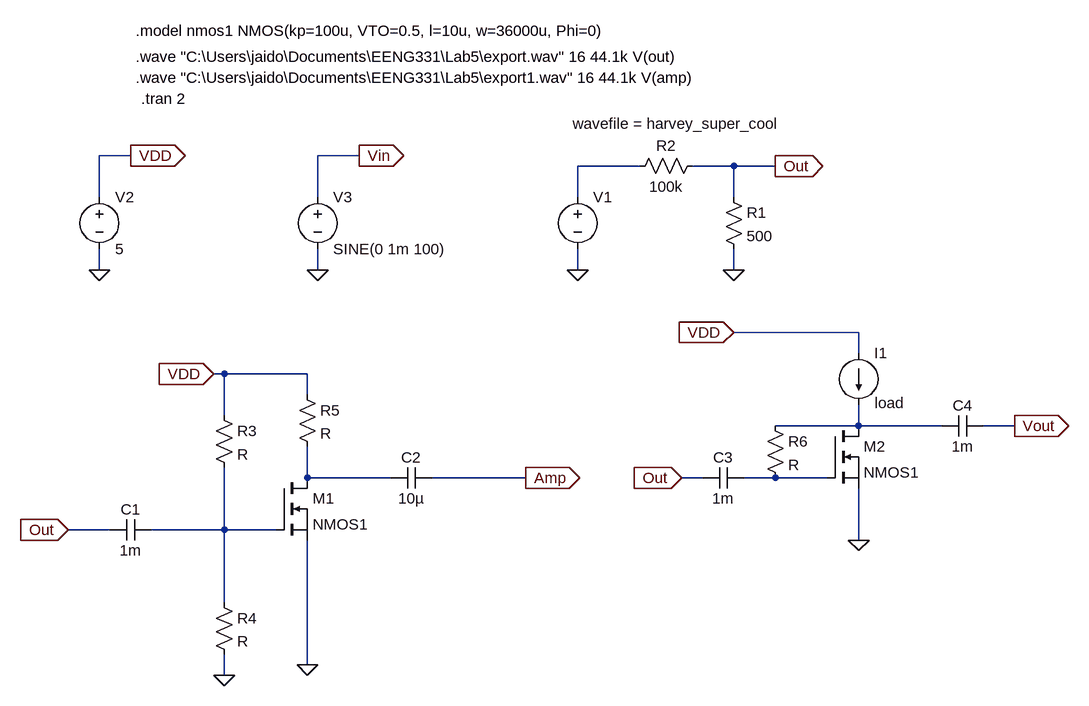
[diagram p0: schematic Lab5.asc]
Lab5.asc, the LTspice schematic file:
Version 4
SHEET 1 1712 852
WIRE 16 32 -32 32
WIRE 368 32 304 32
WIRE 800 48 704 48
WIRE 944 48 880 48
WIRE 1008 48 944 48
WIRE -32 96 -32 32
WIRE 304 96 304 32
WIRE 704 96 704 48
WIRE 944 96 944 48
WIRE -32 208 -32 176
WIRE 304 208 304 176
WIRE 704 208 704 176
WIRE 944 208 944 176
WIRE 1136 304 944 304
WIRE 1136 336 1136 304
WIRE 160 368 144 368
WIRE 288 368 160 368
WIRE 288 400 288 368
WIRE 160 432 160 368
WIRE 1136 448 1136 416
WIRE 1136 448 1008 448
WIRE 1264 448 1136 448
WIRE 1376 448 1328 448
WIRE 288 528 288 480
WIRE 416 528 288 528
WIRE 624 528 480 528
WIRE 896 528 864 528
WIRE 1008 528 960 528
WIRE 1088 528 1008 528
WIRE -16 608 -80 608
WIRE 160 608 160 512
WIRE 160 608 48 608
WIRE 240 608 160 608
WIRE 1136 624 1136 544
WIRE 160 720 160 608
WIRE 288 816 288 624
WIRE 160 832 160 800
FLAG 16 32 VDD
IOPIN 16 32 Out
FLAG -32 208 0
FLAG 304 208 0
FLAG 368 32 Vin
IOPIN 368 32 Out
FLAG 704 208 0
FLAG 944 208 0
FLAG 1008 48 Out
IOPIN 1008 48 Out
FLAG -80 608 Out
IOPIN -80 608 In
FLAG 144 368 VDD
IOPIN 144 368 In
FLAG 624 528 Amp
IOPIN 624 528 Out
FLAG 160 832 0
FLAG 288 816 0
FLAG 944 304 VDD
IOPIN 944 304 In
FLAG 864 528 Out
IOPIN 864 528 In
FLAG 1376 448 Vout
IOPIN 1376 448 Out
FLAG 1136 624 0
SYMBOL voltage -32 80 R0
WINDOW 123 0 0 Left 0
WINDOW 39 0 0 Left 0
SYMATTR InstName V2
SYMATTR Value 5
SYMBOL voltage 304 80 R0
WINDOW 123 0 0 Left 0
WINDOW 39 0 0 Left 0
SYMATTR InstName V3
SYMATTR Value SINE(0 1m 100)
SYMBOL voltage 704 80 R0
WINDOW 3 -8 -97 Left 2
SYMATTR InstName V1
SYMATTR Value wavefile = harvey_super_cool
SYMBOL res 896 32 R90
WINDOW 0 0 56 VBottom 2
WINDOW 3 32 56 VTop 2
SYMATTR InstName R2
SYMATTR Value 100k
SYMBOL res 928 80 R0
SYMATTR InstName R1
SYMATTR Value 500
SYMBOL nmos 240 528 R0
SYMATTR InstName M1
SYMATTR Value NMOS1
SYMBOL res 144 416 R0
SYMATTR InstName R3
SYMBOL res 144 704 R0
SYMATTR InstName R4
SYMBOL res 272 384 R0
SYMATTR InstName R5
SYMBOL cap 48 592 R90
WINDOW 0 0 32 VBottom 2
WINDOW 3 32 32 VTop 2
SYMATTR InstName C1
SYMATTR Value 1m
SYMBOL cap 480 512 R90
WINDOW 0 0 32 VBottom 2
WINDOW 3 32 32 VTop 2
SYMATTR InstName C2
SYMATTR Value 10µ
SYMBOL nmos 1088 448 R0
SYMATTR InstName M2
SYMATTR Value NMOS1
SYMBOL res 992 432 R0
SYMATTR InstName R6
SYMBOL cap 960 512 R90
WINDOW 0 0 32 VBottom 2
WINDOW 3 32 32 VTop 2
SYMATTR InstName C3
SYMATTR Value 1m
SYMBOL cap 1328 432 R90
WINDOW 0 0 32 VBottom 2
WINDOW 3 32 32 VTop 2
SYMATTR InstName C4
SYMATTR Value 1m
SYMBOL current 1136 336 R0
WINDOW 123 0 0 Left 0
WINDOW 39 25 77 Left 2
SYMATTR InstName I1
SYMATTR Value ""
SYMATTR SpiceLine load
TEXT 24 -160 Left 2 !.model nmos1 NMOS(kp=100u, VTO=0.5, l=10u, w=36000u, Phi=0)
TEXT 24 -120 Left 2 !.wave "C:\\Users\\jaido\\Documents\\EENG331\\Lab5\\export.wav" 16 44.1k V(out)
TEXT 24 -88 Left 2 !.wave "C:\\Users\\jaido\\Documents\\EENG331\\Lab5\\export1.wav" 16 44.1k V(amp)
TEXT 32 -56 Left 2 !.tran 2

The netlist it stands for:
* Lab5.asc
V2 VDD 0 5
V3 Vin 0 SINE(0 1m 100)
V1 N001 0 wavefile = harvey_super_cool
R2 Out N001 100k
R1 Out 0 500
M1 N003 N005 0 0 NMOS1
R3 VDD N005 R
R4 N005 0 R
R5 VDD N003 R
C1 N005 Out 1m
C2 Amp N003 10µ
M2 N002 N004 0 0 NMOS1
R6 N002 N004 R
C3 N004 Out 1m
C4 Vout N002 1m
I1 VDD N002 load
.model NMOS NMOS
.model PMOS PMOS
.lib standard.mos
.model nmos1 NMOS(kp=100u, VTO=0.5, l=10u, w=36000u, Phi=0)
.wave "C:\Users\jaido\Documents\EENG331\Lab5\export.wav" 16 44.1k V(out)
.wave "C:\Users\jaido\Documents\EENG331\Lab5\export1.wav" 16 44.1k V(amp)
.tran 2
.backanno
.end